# EAGLE schematic PulT (EAGLE 7.0.0)
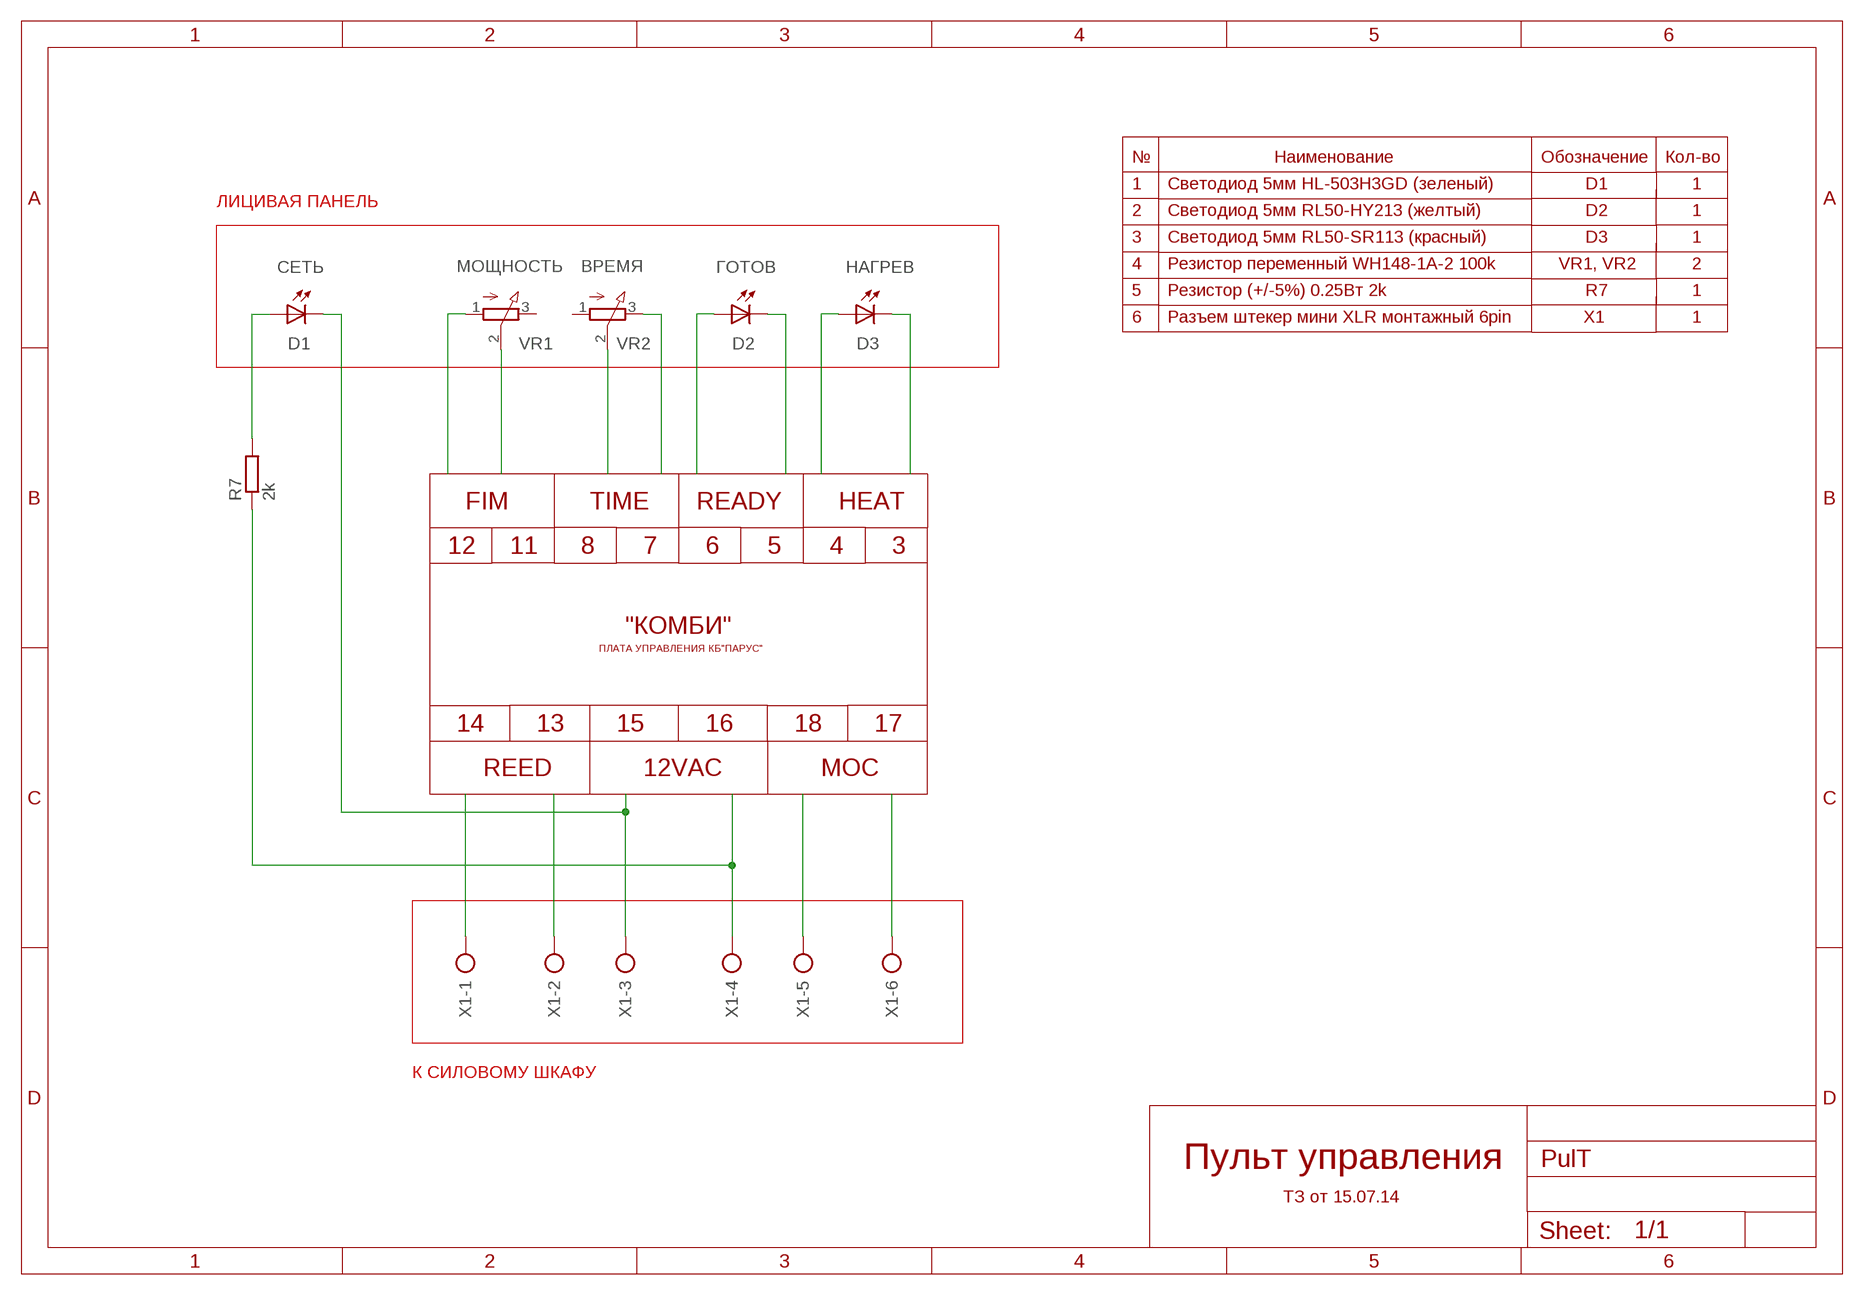
[diagram p0: schematic, sheet 1]

## Parts
R7  2k  R-EU_0207/5V  [0207/5V]
X1  AK500/6  [AK500/6]
ВРЕМЯ  3RP/1610N  [3RP/1610N]
ГОТОВ  LED5MM  [LED5MM]
МОЩНОСТЬ  3RP/1610N  [3RP/1610N]
НАГРЕВ  LED5MM  [LED5MM]
СЕТЬ  LED5MM  [LED5MM]

## Nets
L12V: R7.1 X1.4
N12V: X1.3 СЕТЬ.K(C)
N$1: X1.2
N$2: X1.1
N$3: X1.5
N$4: X1.6
N$14: ГОТОВ.A
N$15: ГОТОВ.K(C)
N$16: НАГРЕВ.A
N$18: ВРЕМЯ.3(E)
N$19: ВРЕМЯ.2(S)
N$20: МОЩНОСТЬ.1(A)
N$21: МОЩНОСТЬ.2(S)
N$24: R7.2 СЕТЬ.A
НАГРЕВ: НАГРЕВ.K(C)
Unconnected: ВРЕМЯ.1(A) МОЩНОСТЬ.3(E)

## Notes on the sheet
- № | Наименование | Обозначение | Кол-во
- 1 | Светодиод 5мм HL-503H3GD (зеленый) | D1 | 1
- ЛИЦИВАЯ ПАНЕЛЬ
- 2 | Светодиод 5мм RL50-HY213 (желтый) | D2 | 1
- 3 | Светодиод 5мм RL50-SR113 (красный) | D3 | 1
- 4 | Резистор переменный WH148-1A-2 100k | VR1, VR2 | 2
- 5 | Резистор (+/-5%) 0.25Вт 2k | R7 | 1
- 6 | Разъем штекер мини XLR монтажный 6pin | X1 | 1
- D1 | VR1 | VR2 | D2 | D3
- FIM | TIME | READY | HEAT
- 12 | 11 | 8 | 7 | 6 | 5 | 4 | 3
- "КОМБИ"
- ПЛАТА УПРАВЛЕНИЯ КБ"ПАРУС"
- 14 | 13 | 15 | 16 | 18 | 17
- REED | 12VAC | МОС
- К СИЛОВОМУ ШКАФУ
- Пульт управления
- ТЗ от 15.07.14

## Library data of the parts
R7 = rcl:R-EU_: RESISTOR, European symbol
X1 = con-ptr500:AK500/6: CONNECTOR; OC_FARNELL: unknown; OC_NEWARK: unknown
ВРЕМЯ МОЩНОСТЬ = pot:3RP/1610N: 16mm Potentiometer one level Source: http://www.alphapotentiometers.net/html/16mm_pot_2.html
ГОТОВ НАГРЕВ СЕТЬ = led:LED: LED OSRAM: - CHIPLED LG R971, LG N971, LY N971, LG Q971, LY Q971, LO R971, LY R971 LH N974, LH R974 LS Q976, LO Q976, LY Q976 LO Q996 - Hyper CHIPLED LW Q18S LB Q993, LB Q99A, LB R99A - SideLED LS A670, LO A670, LY A670, LG A670, LP A670 LB A673, LV A673, LT A673, LW A673 LH A674 LY A675 LS A676, LA A676, LO A676, LY A676, LW A676 LS A679, LY A679, LG A679 - Hyper Micro SIDELED® LS Y876, LA Y876, LO Y876, LY Y876 LT Y87S - SmartLED LW L88C, LW L88S LB L89C, LB L89S, LG L890 LS L89K, LO L89K, LY L89K LS L896, LA L896, LO L896, LY L896 - TOPLED LS T670, LO T670, LY T670, LG T670, LP T670 LSG T670, LSP T670, LSY T670, LOP T670, LYG T670 LG T671, LOG T671, LSG T671 LB T673, LV T673, LT T673, LW T673 LH T674 LS T676, LA T676, LO T676, LY T676, LB T676, LH T676, LSB T676, LW T676 LB T67C, LV T67C, LT T67C, LS T67K, LO T67K, LY T67K, LW E67C LS E67B, LA E67B, LO E67B, LY E67B, LB E67C, LV E67C, LT E67C LW T67C LS T679, LY T679, LG T679 LS T770, LO T770, LY T770, LG T770, LP T770 LB T773, LV T773, LT T773, LW T773 LH T774 LS E675, LA E675, LY E675, LS T675 LS T776, LA T776, LO T776, LY T776, LB T776 LHGB T686 LT T68C, LB T68C - Hyper Mini TOPLED® LB M676 - Mini TOPLED Santana® LG M470 LS M47K, LO M47K, LY M47K Source: http://www.osram.convergy.de LUXEON: - LUMILED® LXK2-PW12-R00, LXK2-PW12-S00, LXK2-PW14-U00, LXK2-PW14-V00 LXK2-PM12-R00, LXK2-PM12-S00, LXK2-PM14-U00 LXK2-PE12-Q00, LXK2-PE12-R00, LXK2-PE12-S00, LXK2-PE14-T00, LXK2-PE14-U00 LXK2-PB12-K00, LXK2-PB12-L00, LXK2-PB12-M00, LXK2-PB14-N00, LXK2-PB14-P00, LXK2-PB14-Q00 LXK2-PR12-L00, LXK2-PR12-M00, LXK2-PR14-Q00, LXK2-PR14-R00 LXK2-PD12-Q00, LXK2-PD12-R00, LXK2-PD12-S00 LXK2-PH12-R00, LXK2-PH12-S00 LXK2-PL12-P00, LXK2-PL12-Q00, LXK2-PL12-R00 Source: www.luxeon.com KINGBRIGHT: KA-3528ASYC Source: www.kingbright.com